# EAGLE design main (EAGLE 8.6.3)
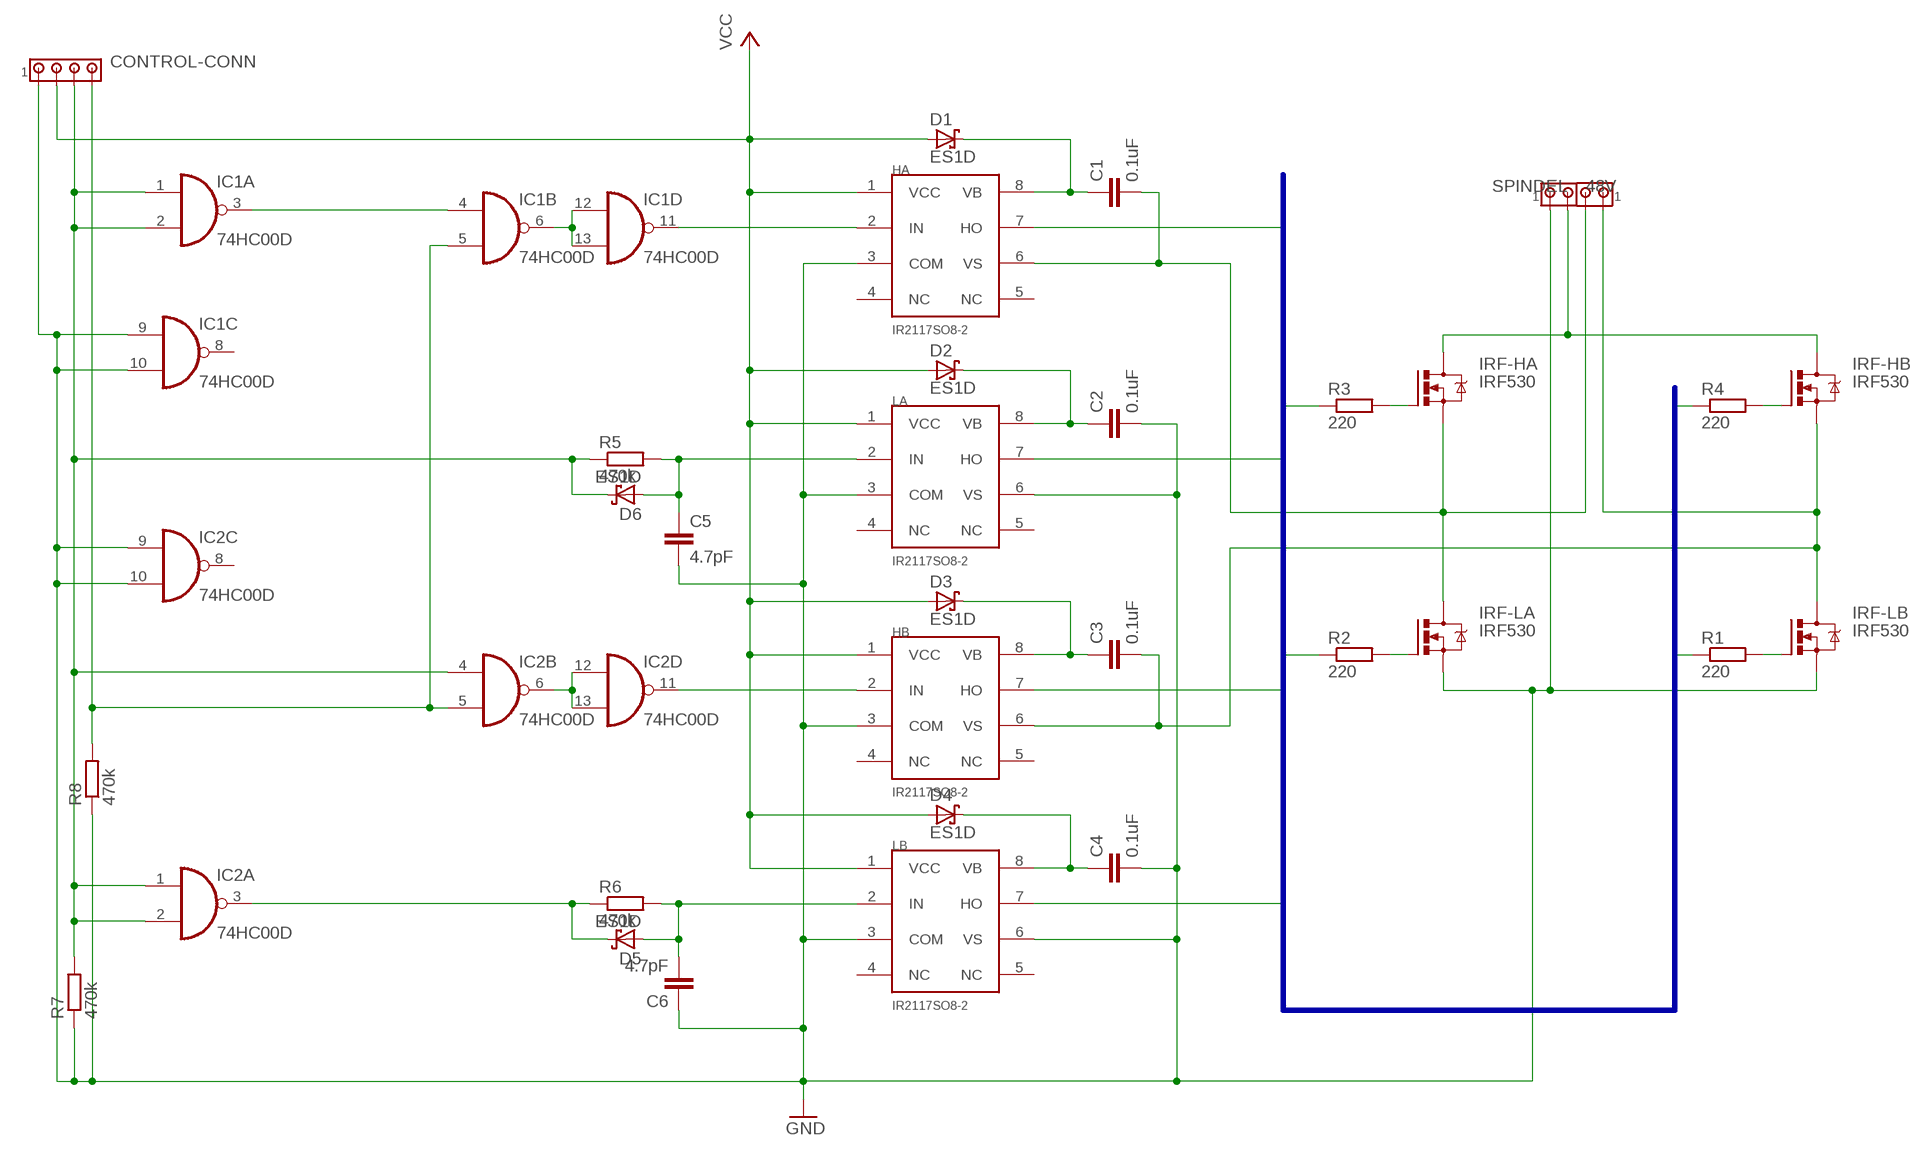
[diagram p0: schematic, sheet 1]

## Parts
48V  MTA02-100  [10X02MTA]
C1  0.1uF  C-EUC0805K  [C0805K]
C2  0.1uF  C-EUC0805K  [C0805K]
C3  0.1uF  C-EUC0805K  [C0805K]
C4  0.1uF  C-EUC0805K  [C0805K]
C5  4.7pF  C-EUC0805K  [C0805K]
C6  4.7pF  C-EUC0805K  [C0805K]
CONTROL-CONN  MTA04-100  [10X04MTA]
D1  ES1D  SCHOTTKY-DIODESMD  [SMB]
D2  ES1D  SCHOTTKY-DIODESMD  [SMB]
D3  ES1D  SCHOTTKY-DIODESMD  [SMB]
D4  ES1D  SCHOTTKY-DIODESMD  [SMB]
D5  ES1D  SCHOTTKY-DIODESMD  [SMB]
D6  ES1D  SCHOTTKY-DIODESMD  [SMB]
HA  IR2117SO8-2  [SO8-2]
HB  IR2117SO8-2  [SO8-2]
IC1  74HC00D  [SO14]
IC2  74HC00D  [SO14]
IRF-HA  IRF530  [TO220BV]
IRF-HB  IRF530  [TO220BV]
IRF-LA  IRF530  [TO220BV]
IRF-LB  IRF530  [TO220BV]
LA  IR2117SO8-2  [SO8-2]
LB  IR2117SO8-2  [SO8-2]
R1  220  R-EU_R0402  [R0402]
R2  220  R-EU_R0402  [R0402]
R3  220  R-EU_R0402  [R0402]
R4  220  R-EU_R0402  [R0402]
R5  470k  R-EU_R0603  [R0603]
R6  470k  R-EU_R0603  [R0603]
R7  470k  R-EU_R0603  [R0603]
R8  470k  R-EU_R0603  [R0603]
SPINDEL  MTA02-100  [10X02MTA]

## Nets
48V: 48V.2 IRF-HA.D IRF-HB.D
!DIR: D5.C IC2.3(A:O) R6.1
A-SIDE: C1.2 HA.6(VS) IRF-HA.S IRF-LA.D SPINDEL.2
B-SIDE: C3.2 HB.6(VS) IRF-HB.S IRF-LB.D SPINDEL.1
DIR: CONTROL-CONN.3 D6.C IC1.1(A:I0) IC1.2(A:I1) IC2.1(A:I0) IC2.2(A:I1) IC2.4(B:I0) R5.1 R7.2
GND: 48V.1 C2.2 C4.2 C5.2 C6.1 CONTROL-CONN.1 HA.3(COM) HB.3(COM) IC1.9(C:I0) IC1.10(C:I1) IC2.9(C:I0) IC2.10(C:I1) IRF-LA.S IRF-LB.S LA.3(COM) LA.6(VS) LB.3(COM) LB.6(VS) R7.1 R8.1
HA: HA.7(HO) R3.1
HA-VB: C1.1 D1.C HA.8(VB)
HB: HB.7(HO) R4.1
HB-VB: C3.1 D3.C HB.8(VB)
LA: LA.7(HO) R2.1
LA-VB: C2.1 D2.C LA.8(VB)
LB: LB.7(HO) R1.1
LB-VB: C4.1 D4.C LB.8(VB)
N$1: C5.1 D6.A LA.2(IN) R5.2
N$3: HA.2(IN) IC1.11(D:O)
N$4: C6.2 D5.A LB.2(IN) R6.2
N$5: IRF-HA.G R3.2
N$6: IRF-LA.G R2.2
N$7: IRF-HB.G R4.2
N$8: IRF-LB.G R1.2
N$10: IC2.6(B:O) IC2.12(D:I0) IC2.13(D:I1)
N$11: IC1.6(B:O) IC1.12(D:I0) IC1.13(D:I1)
N$12: HB.2(IN) IC2.11(D:O)
N$13: IC1.3(A:O) IC1.4(B:I0)
PWM: CONTROL-CONN.4 IC1.5(B:I1) IC2.5(B:I1) R8.2
VCC: CONTROL-CONN.2 D1.A D2.A D3.A D4.A HA.1(VCC) HB.1(VCC) LA.1(VCC) LB.1(VCC)
Unconnected: HA.4(NC) HA.5(NC) HB.4(NC) HB.5(NC) IC1.8(C:O) IC2.8(C:O) LA.4(NC) LA.5(NC) LB.4(NC) LB.5(NC)

## Buses
HA,LA,HB,LB

## Power pins joined to a net without a drawn wire
GND: IC1.7(P:GND) IC2.7(P:GND)
VCC: IC1.14(P:VCC) IC2.14(P:VCC)

## Library data of the parts
48V SPINDEL = con-amp:MTA02-100: AMP connector
C1-C6 = rcl:C-EU: CAPACITOR, European symbol; SPICEPREFIX: C
CONTROL-CONN = con-amp:MTA04-100: AMP connector
D1-D6 = diode:SCHOTTKY-DIODE: Schottky Diode
HA = irf-2:IR2117: High side driver; SPICEPREFIX: X
HB LA LB = irf-2:IR2117: High side driver
IC1 IC2 = 74xx-eu:74*00: Quad 2-input NAND gate
IRF-HA IRF-HB IRF-LA IRF-LB = transistor-power:IRF530: HEXFET Power MOSFET
R1-R4 = resistor:R-EU_: RESISTOR, European symbol
R5-R8 = rcl:R-EU_: RESISTOR, European symbol; SPICEPREFIX: R

## Board
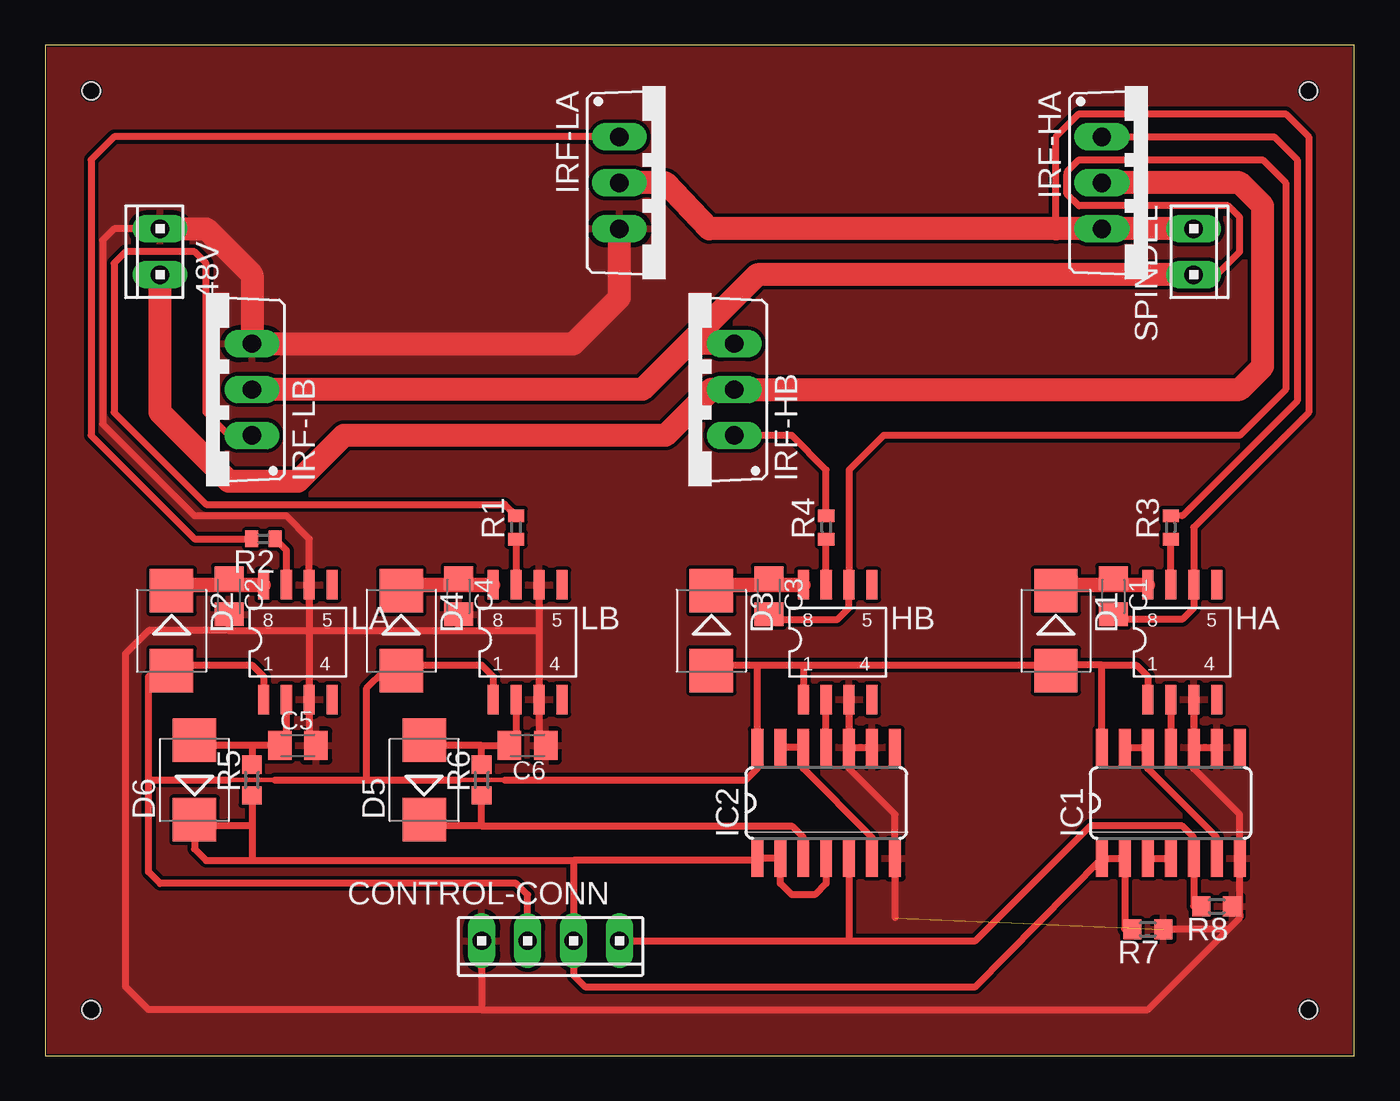
[diagram p1: board, top side]

Size 72.38 x 55.87 mm. Coordinates in mm from the lower left corner, seen from the top.
Outline: 0,0 72.38,0 72.38,55.87 0,55.87 0,0
Copper layers (1*16): Top 0.035mm / dielectric 1.5mm / Bottom 0.035mm
Design rules "default *": minimum track width 0.4mm, minimum drill 0.8mm, track to track 0.2mm, track to pad 0.2mm, pad to pad 0.4mm, via to via 0.4mm, smd to smd 0.1mm, copper to edge 0.1mm, drill to drill 1mm, minimum pad ring 10mil, minimum via ring 8mil, stop-mask expansion 4mil, vias tented up to drill 0mil, thermal gap 10mil
Holes 1 mm at 2.54,2.54 2.54,53.34 69.85,53.34 69.85,2.54

### Footprints (pad centres in the part's own frame; a part is rotated, then mirrored left to right if it is on the bottom)
10X02MTA = drill 1.016 long: 1 1.27,0; 2 -1.27,0
C0805K = smd 1.3 x 1.6: 1 -1,0; 2 1,0
10X04MTA = drill 1.016 long: 1 3.81,0; 2 1.27,0; 3 -1.27,0; 4 -3.81,0
SMB = smd 2.4 x 2.4: A 2.2,0; C -2.2,0
SO8-2 = smd 0.61 x 1.626: 1 -2.54,-2.54; 2 -1.27,-2.54; 3 0,-2.54; 4 1.27,-2.54; 5 1.27,3.81; 6 0,3.81; 7 -1.27,3.81; 8 -2.54,3.81
SO14 = smd 0.66 x 2.032: 1 -3.81,-3.073; 2 -2.54,-3.073; 3 -1.27,-3.073; 4 0,-3.073; 5 1.27,-3.073; 6 2.54,-3.073; 7 3.81,-3.073; 8 3.81,3.073; 9 2.54,3.073; 10 1.27,3.073; 11 0,3.073; 12 -1.27,3.073; 13 -2.54,3.073; 14 -3.81,3.073
TO220BV = drill 1.016 long: D 0,-2.54; G -2.54,-2.54; S 2.54,-2.54
R0402 = smd 0.7 x 0.9: 1 -0.65,0; 2 0.65,0
R0603 = smd 1 x 1.1: 1 -0.85,0; 2 0.85,0

### Placement (x,y rotation side)
48V  6.35,44.45 90 top
C1  59.05,25.4 270 top
C2  10.16,25.4 270 top
C3  40.01,25.4 270 top
C4  22.86,25.4 270 top
C5  13.97,17.14 0 top
C6  26.67,17.14 180 top
CONTROL-CONN  27.94,6.35 180 top
D1  55.88,23.5 270 top
D2  6.99,23.5 270 top
D3  36.83,23.5 270 top
D4  19.68,23.5 270 top
D5  20.95,15.24 90 top
D6  8.26,15.24 90 top
HA  63.5,22.23 0 top
HB  44.45,22.23 0 top
IC1  62.23,13.97 0 top
IC2  43.18,13.97 0 top
IRF-HA  60.96,48.26 270 top
IRF-HB  35.56,36.83 90 top
IRF-LA  34.29,48.26 270 top
IRF-LB  8.89,36.83 90 top
LA  14.61,22.23 0 top
LB  27.3,22.23 0 top
R1  26.04,29.21 90 top
R2  12.06,28.57 180 top
R3  62.23,29.21 90 top
R4  43.18,29.21 90 top
R5  11.43,15.24 90 top
R6  24.13,15.24 90 top
R7  60.96,6.99 180 top
R8  64.77,8.26 180 top
SPINDEL  63.5,44.45 270 top

### Tracks (layer width: path | path; a pad name or v marks a point on that pad's centre or on a via)
48V
  Top 1.27: IRF-HA.D 66.04,48.26 67.31,46.99 67.31,38.1 66.04,36.83 IRF-HB.D 36.83,36.83 34.29,34.29 16.51,34.29 13.97,31.75 10.16,31.75 6.35,35.56 48V.2
!DIR
  Top 0.4: IC2.3 41.91,12.06 41.27,12.7 24.13,12.7 | 24.13,12.7 R6.1 | 24.13,12.7 21.59,12.7 21.55,12.73 21.25,13.03 D5.C
A-SIDE
  Top 0.4: IRF-LA.D 30.48,48.26 | 55.88,45.72 55.88,50.8 57.15,52.07 68.58,52.07 69.85,50.8 69.85,35.56 63.5,29.21 HA.6 63.5,24.77 62.87,24.13 59.05,24.13 C1.2
  Top 1.27: SPINDEL.2 IRF-HA.S 55.88,45.72 36.7,45.72 34.29,48.26 IRF-LA.D
B-SIDE
  Top 0.4: IRF-LB.D 10.16,36.83 | SPINDEL.1 64.77,43.18 66.04,44.45 66.04,46.35 65.41,46.99 57.15,46.99 56.5,47.64 56.5,48.74 56.52,48.76 56.52,48.9 57.15,49.53 67.31,49.53 68.58,48.26 68.58,36.83 66.04,34.29 46.35,34.29 44.45,32.38 HB.6 44.45,24.77 43.81,24.13 40.27,24.13 C3.2
  Top 1.27: IRF-HB.S 35.56,39.37 | 35.56,39.37 33.02,36.83 IRF-LB.D | SPINDEL.1 39.37,43.18 35.56,39.37
DIR
  Top 0.4: 29.21,10.79 39.27,10.79 IC2.1 IC2.2 40.64,9.53 41.27,8.89 42.55,8.89 43.18,9.53 IC2.4 | 11.43,10.79 8.89,10.79 8.26,11.43 D6.C 8.6,12.7 11.43,12.7 | 11.43,10.79 29.21,10.79 | 29.21,10.79 CONTROL-CONN.3 29.21,4.45 29.84,3.81 51.44,3.81 IC1.1 IC1.2 59.69,6.99 R7.2 | R5.1 11.43,12.7 | 11.43,12.7 11.43,10.79
GND  (1 unrouted)
  Top 0.4: 48V.1 3.81,45.72 3.17,45.09 3.17,34.92 8.26,29.84 13.34,29.84 14.61,28.57 LA.6 14.61,23.5 | IC2.10 HB.3 44.45,20.32 | IC2.10 IC2.9 | IC1.10 IC1.9 | HA.3 IC1.10 | 66.04,8.26 IC1.7 66.04,13.34 63.5,15.88 IC1.10 | 66.04,8.26 R8.1 66.04,7.83 | 10.15,23.5 14.61,23.5 | 14.61,23.5 22.86,23.5 | 22.86,23.5 27.3,23.5 | LB.6 27.3,23.5 | C4.2 22.86,23.5 | C2.2 10.15,23.5 | 66.04,7.83 66.04,8.26 | 27.3,23.5 LB.3 27.3,17.51 C6.1 | 14.61,23.5 LA.3 14.61,17.51 C5.2 | 10.15,23.5 5.71,23.5 4.45,22.23 4.45,3.81 5.71,2.54 24.13,2.54 | CONTROL-CONN.1 24.13,2.54 | 66.04,7.83 66.04,7.62 65.41,6.99 | 65.41,6.99 R7.1 61.81,6.77 | IC2.10 44.45,15.88 46.99,13.34 IC2.7 46.99,7.62 | 24.13,2.54 60.96,2.54 65.41,6.99
  Top 1.27: IRF-LA.S 31.75,41.91 29.21,39.37 IRF-LB.S 11.43,43.18 8.89,45.72 48V.1
  pour Top: 0,0 0,55.88 72.39,55.88 72.39,0
HA
  Top 0.4: HA.7 R3.1
HA-VB
  Top 0.4: HA.8 60.96,26.67
  Top 0.8: HA.8 59.05,26.04 | 59.05,26.04 56.22,26.04 D1.C | C1.1 59.05,26.04
  Top 1.016: D1.C 56.59,26.4
HB
  Top 0.4: HB.7 R4.1
HB-VB
  Top 0.813: HB.8 40.01,26.04 | 40.01,26.04 37.17,26.04 D3.C | C3.1 40.01,26.04
LA
  Top 0.4: LA.7 13.34,27.94 R2.1
LA-VB
  Top 0.813: LA.8 10.16,26.04 | 10.16,26.04 7.33,26.04 D2.C | C2.1 10.16,26.04
LB
  Top 0.4: R1.1 LB.7
LB-VB
  Top 0.813: LB.8 22.86,26.04 | 22.86,26.04 20.02,26.04 D4.C | C4.1 22.86,26.04
N$1
  Top 0.4: LA.2 13.34,17.51 C5.1 11.43,17.14 | 11.43,17.14 R5.2 | 11.43,17.14 8.55,17.14 D6.A
N$3
  Top 0.4: HA.2 IC1.11
N$4
  Top 0.4: R6.2 24.13,17.14 | 24.13,17.14 C6.2 26.04,17.51 LB.2 | 24.13,17.14 21.25,17.14 D5.A
N$5
  Top 0.4: IRF-HA.G 67.94,50.8 69.22,49.53 69.22,36.2 62.87,29.84 R3.2
N$6
  Top 0.4: IRF-LA.G 3.81,50.8 2.54,49.53 2.54,34.29 8.26,28.57 R2.2
N$7
  Top 0.4: R4.2 43.18,32.38 41.27,34.29 IRF-HB.G
N$8
  Top 0.4: IRF-LB.G 10.16,34.29 8.89,35.56 8.89,43.81 8.26,44.45 4.45,44.45 3.81,43.81 3.81,35.56 8.89,30.48 25.4,30.48 R1.2
N$10
  Top 0.4: IC2.13 IC2.12 41.91,15.88 45.72,12.06 IC2.6
N$11
  Top 0.4: IC1.13 IC1.12 60.96,15.88 64.77,12.06 IC1.6
N$12
  Top 0.4: IC2.11 HB.2
N$13
  Top 0.4: IC1.3 IC1.4
PWM
  Top 0.4: R8.2 63.5,8.26 IC1.5 63.5,12.06 62.87,12.7 57.78,12.7 51.44,6.35 44.45,6.35 | CONTROL-CONN.4 44.45,6.35 | IC2.5 44.45,6.35
VCC
  Top 0.254: 10.16,15.24 12.7,15.24 | 22.86,15.24 25.4,15.24
  Top 0.4: 56.05,21.73 D1.A 56.17,21.59 | 39.37,21.59 36.83,21.59 D3.A | 39.37,21.59 41.91,21.59 | 39.37,21.59 IC2.14 39.37,15.88 38.73,15.24 25.4,15.24 | LB.1 24.77,20.95 24.13,21.59 19.68,21.59 D4.A 18.75,21.3 17.78,20.32 17.78,15.24 | 41.91,21.59 HB.1 | 5.71,15.24 5.71,10.16 6.35,9.53 26.04,9.53 26.67,8.89 CONTROL-CONN.2 | 5.71,15.24 10.16,15.24 | 12.7,15.24 17.78,15.24 | 17.78,15.24 22.86,15.24 | LA.1 12.06,20.95 11.43,21.59 7.28,21.59 D2.A 6.05,21.3 5.71,20.95 5.71,15.24 | HA.1 60.96,20.95 60.33,21.59 58.42,21.59 | 58.42,21.59 56.17,21.59 | IC1.14 58.42,21.59 | 41.91,21.59 56.17,21.59